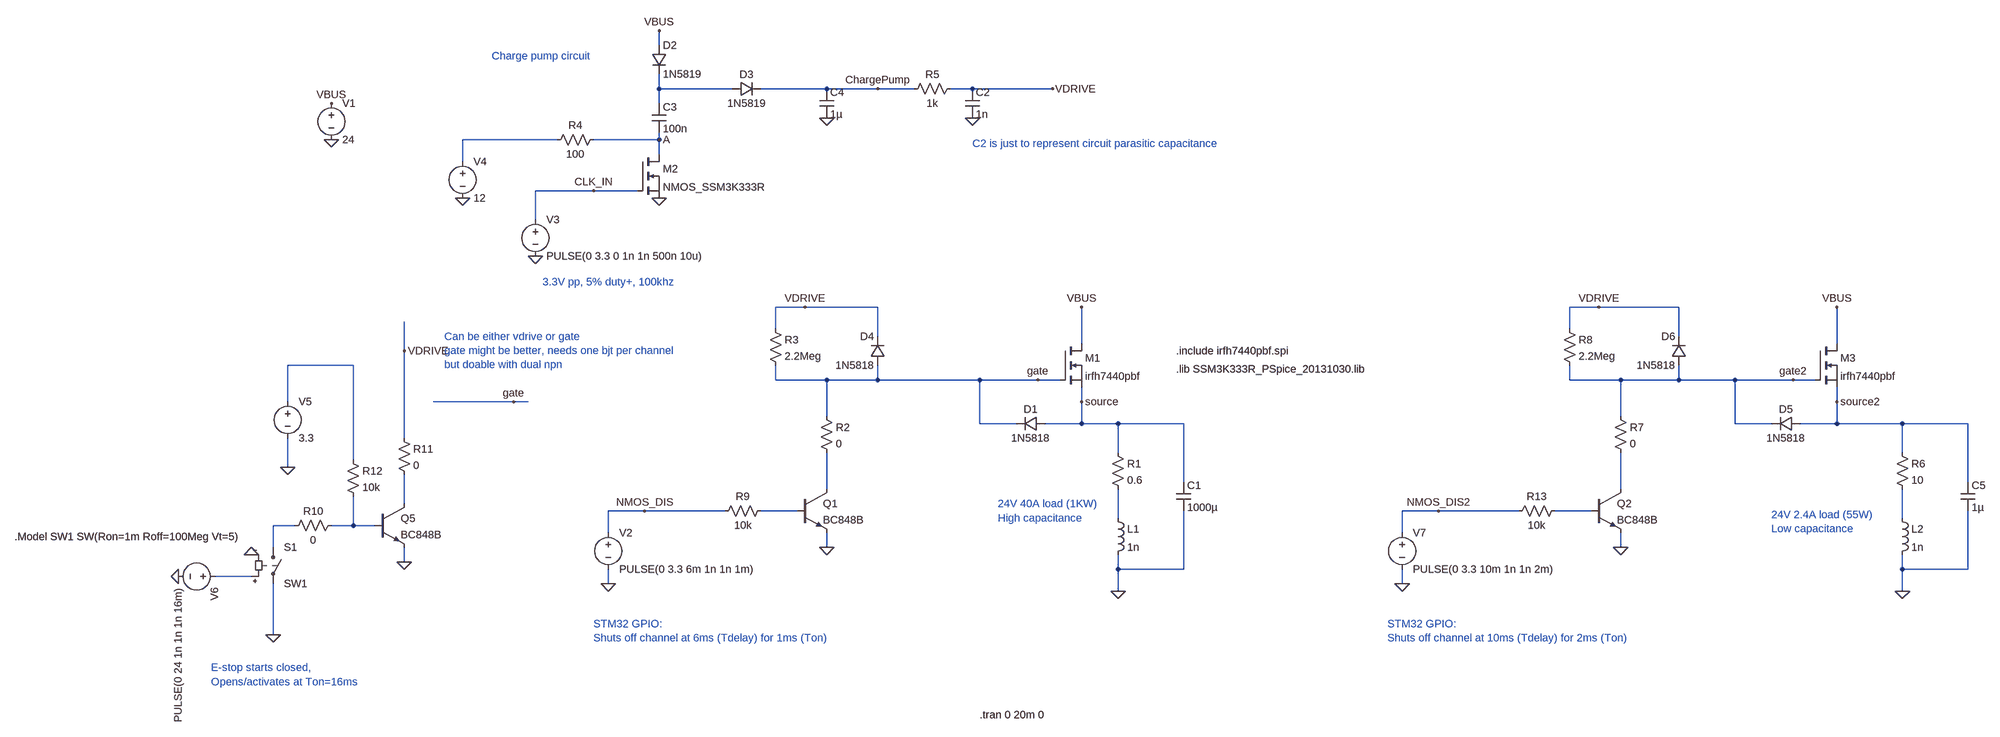
[diagram p0: schematic Bluesat_MPM_Testing.asc]
Bluesat_MPM_Testing.asc, the LTspice schematic file:
Version 4.1
SHEET 1 2628 980
WIRE -672 -576 -672 -608
WIRE -672 -480 -672 -512
WIRE -512 -480 -672 -480
WIRE -304 -480 -448 -480
WIRE -192 -480 -304 -480
WIRE -112 -480 -192 -480
WIRE 16 -480 -32 -480
WIRE 192 -480 16 -480
WIRE -672 -448 -672 -480
WIRE -896 -368 -1104 -368
WIRE -672 -368 -672 -384
WIRE -672 -368 -816 -368
WIRE -672 -336 -672 -368
WIRE -1104 -320 -1104 -368
WIRE -816 -256 -944 -256
WIRE -720 -256 -816 -256
WIRE -944 -192 -944 -256
WIRE -352 0 -416 0
WIRE -192 0 -352 0
WIRE 1392 0 1328 0
WIRE 1568 0 1392 0
WIRE -416 48 -416 0
WIRE 1328 48 1328 0
WIRE -192 64 -192 0
WIRE 1568 64 1568 0
WIRE 256 80 256 0
WIRE 2000 80 2000 0
WIRE -1232 96 -1232 32
WIRE -1344 128 -1488 128
WIRE -416 160 -416 128
WIRE -304 160 -416 160
WIRE -192 160 -192 128
WIRE -192 160 -304 160
WIRE 32 160 -192 160
WIRE 160 160 32 160
WIRE 208 160 160 160
WIRE 1328 160 1328 128
WIRE 1440 160 1328 160
WIRE 1568 160 1568 128
WIRE 1568 160 1440 160
WIRE 1776 160 1568 160
WIRE 1904 160 1776 160
WIRE 1952 160 1904 160
WIRE -1488 208 -1488 128
WIRE -992 208 -1168 208
WIRE -960 208 -992 208
WIRE 256 208 256 176
WIRE 2000 208 2000 176
WIRE -304 240 -304 160
WIRE 1440 240 1440 160
WIRE 32 256 32 160
WIRE 112 256 32 256
WIRE 256 256 256 208
WIRE 256 256 176 256
WIRE 336 256 256 256
WIRE 480 256 336 256
WIRE 1776 256 1776 160
WIRE 1856 256 1776 256
WIRE 2000 256 2000 208
WIRE 2000 256 1920 256
WIRE 2144 256 2000 256
WIRE 2288 256 2144 256
WIRE -1232 288 -1232 96
WIRE 336 320 336 256
WIRE 2144 320 2144 256
WIRE -1344 336 -1344 128
WIRE -1488 352 -1488 288
WIRE 480 384 480 256
WIRE 2288 384 2288 256
WIRE -304 400 -304 320
WIRE 1440 400 1440 320
WIRE -1232 432 -1232 368
WIRE -704 448 -784 448
WIRE -528 448 -704 448
WIRE -368 448 -448 448
WIRE 1040 448 960 448
WIRE 1216 448 1040 448
WIRE 1376 448 1296 448
WIRE 336 464 336 400
WIRE 2144 464 2144 400
WIRE -1472 480 -1520 480
WIRE -1344 480 -1344 416
WIRE -1344 480 -1392 480
WIRE -1296 480 -1344 480
WIRE -784 496 -784 448
WIRE 960 496 960 448
WIRE -1520 528 -1520 480
WIRE -304 528 -304 496
WIRE 1440 528 1440 496
WIRE -1232 560 -1232 528
WIRE 336 576 336 544
WIRE 480 576 480 448
WIRE 480 576 336 576
WIRE 2144 576 2144 544
WIRE 2288 576 2288 448
WIRE 2288 576 2144 576
WIRE -1568 592 -1648 592
WIRE -784 608 -784 576
WIRE 960 608 960 576
WIRE 336 624 336 576
WIRE 2144 624 2144 576
WIRE -1520 720 -1520 608
FLAG -1392 -368 0
FLAG 256 0 VBUS
FLAG -1392 -448 VBUS
FLAG -784 608 0
FLAG 336 624 0
FLAG -304 -416 0
FLAG -944 -112 0
FLAG -672 -240 0
FLAG -1104 -240 0
FLAG -672 -608 VBUS
FLAG -672 -368 A
FLAG -816 -256 CLK_IN
FLAG -304 528 0
FLAG 192 -480 VDRIVE
FLAG -704 448 NMOS_DIS
FLAG -352 0 VDRIVE
FLAG -1568 544 0
FLAG -1728 592 0
FLAG 160 160 gate
FLAG 256 208 source
FLAG -1520 720 0
FLAG -1232 560 0
FLAG -1232 96 VDRIVE
FLAG -1488 352 0
FLAG 16 -416 0
FLAG 2000 0 VBUS
FLAG 960 608 0
FLAG 1440 528 0
FLAG 1040 448 NMOS_DIS2
FLAG 1392 0 VDRIVE
FLAG 1904 160 gate2
FLAG 2000 208 source2
FLAG 2144 624 0
FLAG -192 -480 ChargePump
FLAG -992 208 gate
SYMBOL nmos 208 80 R0
SYMATTR InstName M1
SYMATTR Value irfh7440pbf
SYMATTR Prefix X
SYMBOL voltage -1392 -464 R0
SYMATTR InstName V1
SYMATTR Value 24
SYMBOL voltage -784 480 R0
WINDOW 123 0 0 Left 0
WINDOW 39 0 0 Left 0
SYMATTR InstName V2
SYMATTR Value PULSE(0 3.3 6m 1n 1n 1m)
SYMBOL res 320 304 R0
SYMATTR InstName R1
SYMATTR Value 0.6
SYMBOL ind 320 448 R0
SYMATTR InstName L1
SYMATTR Value 1n
SYMBOL cap 464 384 R0
SYMATTR InstName C1
SYMATTR Value 1000µ
SYMBOL diode 176 240 R90
WINDOW 0 0 32 VBottom 2
WINDOW 3 32 32 VTop 2
SYMATTR InstName D1
SYMATTR Value 1N5818
SYMBOL res -320 224 R0
SYMATTR InstName R2
SYMATTR Value 0
SYMBOL nmos -720 -336 R0
SYMATTR InstName M2
SYMATTR Value NMOS_SSM3K333R
SYMATTR Prefix X
SYMBOL cap -688 -448 R0
SYMATTR InstName C3
SYMATTR Value 100n
SYMBOL diode -688 -576 R0
SYMATTR InstName D2
SYMATTR Value 1N5819
SYMBOL diode -512 -464 R270
WINDOW 0 32 32 VTop 2
WINDOW 3 0 32 VBottom 2
SYMATTR InstName D3
SYMATTR Value 1N5819
SYMBOL cap -320 -480 R0
SYMATTR InstName C4
SYMATTR Value 1µ
SYMBOL voltage -944 -208 R0
WINDOW 123 0 0 Left 0
WINDOW 39 0 0 Left 0
SYMATTR InstName V3
SYMATTR Value PULSE(0 3.3 0 1n 1n 500n 10u)
SYMBOL voltage -1104 -336 R0
SYMATTR InstName V4
SYMATTR Value 12
SYMBOL res -800 -384 R90
WINDOW 0 0 56 VBottom 2
WINDOW 3 32 56 VTop 2
SYMATTR InstName R4
SYMATTR Value 100
SYMBOL npn -368 400 R0
SYMATTR InstName Q1
SYMATTR Value BC848B
SYMBOL diode -176 128 R180
WINDOW 0 24 64 Left 2
WINDOW 3 24 0 Left 2
SYMATTR InstName D4
SYMATTR Value 1N5818
SYMBOL res -432 32 R0
SYMATTR InstName R3
SYMATTR Value 2.2Meg
SYMBOL res -128 -464 R270
WINDOW 0 32 56 VTop 2
WINDOW 3 0 56 VBottom 2
SYMATTR InstName R5
SYMATTR Value 1k
SYMBOL sw -1520 512 R0
SYMATTR InstName S1
SYMATTR Value SW1
SYMBOL voltage -1632 592 R90
WINDOW 123 0 0 Left 0
WINDOW 39 0 0 Left 0
SYMATTR InstName V6
SYMATTR Value PULSE(0 24 1n 1n 1n 16m)
SYMBOL npn -1296 432 R0
SYMATTR InstName Q5
SYMATTR Value BC848B
SYMBOL res -1376 464 R90
WINDOW 0 0 56 VBottom 2
WINDOW 3 32 56 VTop 2
SYMATTR InstName R10
SYMATTR Value 0
SYMBOL voltage -1488 192 R0
SYMATTR InstName V5
SYMATTR Value 3.3
SYMBOL res -1248 272 R0
SYMATTR InstName R11
SYMATTR Value 0
SYMBOL res -1360 320 R0
SYMATTR InstName R12
SYMATTR Value 10k
SYMBOL cap 0 -480 R0
SYMATTR InstName C2
SYMATTR Value 1n
SYMBOL nmos 1952 80 R0
SYMATTR InstName M3
SYMATTR Value irfh7440pbf
SYMATTR Prefix X
SYMBOL diode 1920 240 R90
WINDOW 0 0 32 VBottom 2
WINDOW 3 32 32 VTop 2
SYMATTR InstName D5
SYMATTR Value 1N5818
SYMBOL res 1424 224 R0
SYMATTR InstName R7
SYMATTR Value 0
SYMBOL npn 1376 400 R0
SYMATTR InstName Q2
SYMATTR Value BC848B
SYMBOL diode 1584 128 R180
WINDOW 0 24 64 Left 2
WINDOW 3 24 0 Left 2
SYMATTR InstName D6
SYMATTR Value 1N5818
SYMBOL res 1312 32 R0
SYMATTR InstName R8
SYMATTR Value 2.2Meg
SYMBOL res 2128 304 R0
SYMATTR InstName R6
SYMATTR Value 10
SYMBOL ind 2128 448 R0
SYMATTR InstName L2
SYMATTR Value 1n
SYMBOL cap 2272 384 R0
SYMATTR InstName C5
SYMATTR Value 1µ
SYMBOL voltage 960 480 R0
WINDOW 123 0 0 Left 0
WINDOW 39 0 0 Left 0
SYMATTR InstName V7
SYMATTR Value PULSE(0 3.3 10m 1n 1n 2m)
SYMBOL res -432 432 R90
WINDOW 0 0 56 VBottom 2
WINDOW 3 32 56 VTop 2
SYMATTR InstName R9
SYMATTR Value 10k
SYMBOL res 1312 432 R90
WINDOW 0 0 56 VBottom 2
WINDOW 3 32 56 VTop 2
SYMATTR InstName R13
SYMATTR Value 10k
TEXT 32 896 Left 2 !.tran 0 20m 0
TEXT 464 96 Left 2 !.include irfh7440pbf.spi
TEXT 464 136 Left 2 !.lib SSM3K333R_PSpice_20131030.lib
TEXT -2088 504 Left 2 !.Model SW1 SW(Ron=1m Roff=100Meg Vt=5)
TEXT 16 -360 Left 2 ;C2 is just to represent circuit parasitic capacitance
TEXT -1656 792 Left 2 ;E-stop starts closed,\nOpens/activates at Ton=16ms
TEXT -928 -56 Left 2 ;3.3V pp, 5% duty+, 100khz
TEXT -816 696 Left 2 ;STM32 GPIO:\nShuts off channel at 6ms (Tdelay) for 1ms (Ton)
TEXT 928 696 Left 2 ;STM32 GPIO:\nShuts off channel at 10ms (Tdelay) for 2ms (Ton)
TEXT 1856 456 Left 2 ;24V 2.4A load (55W)\nLow capacitance
TEXT 72 432 Left 2 ;24V 40A load (1KW)\nHigh capacitance
TEXT -1040 -552 Left 2 ;Charge pump circuit
TEXT -1144 64 Left 2 ;Can be either vdrive or gate\ngate might be better, needs one bjt per channel\nbut doable with dual npn

The netlist it stands for:
* Bluesat_MPM_Testing.asc
X§M1 VBUS gate source irfh7440pbf  ; pins D G S
V1 VBUS 0 24
V2 NMOS_DIS 0 PULSE(0 3.3 6m 1n 1n 1m)
R1 source N009 0.6
L1 N009 0 1n
C1 source 0 1000µ
D1 source gate 1N5818
R2 gate N004 0
X§M2 A CLK_IN 0 NMOS_SSM3K333R  ; pins D G S
C3 N001 A 100n
D2 VBUS N001 1N5819
D3 N001 ChargePump 1N5819
C4 ChargePump 0 1µ
V3 CLK_IN 0 PULSE(0 3.3 0 1n 1n 500n 10u)
V4 N002 0 12
R4 A N002 100
Q1 N004 N007 0 0 BC848B
D4 gate VDRIVE 1N5818
R3 VDRIVE gate 2.2Meg
R5 ChargePump VDRIVE 1k
S1 N011 0 N013 0 SW1
V6 N013 0 PULSE(0 24 1n 1n 1n 16m)
Q5 N006 N012 0 0 BC848B
R10 N012 N011 0
V5 N003 0 3.3
R11 VDRIVE N006 0
R12 N003 N012 10k
C2 VDRIVE 0 1n
X§M3 VBUS gate2 source2 irfh7440pbf  ; pins D G S
D5 source2 gate2 1N5818
R7 gate2 N005 0
Q2 N005 N008 0 0 BC848B
D6 gate2 VDRIVE 1N5818
R8 VDRIVE gate2 2.2Meg
R6 source2 N010 10
L2 N010 0 1n
C5 source2 0 1µ
V7 NMOS_DIS2 0 PULSE(0 3.3 10m 1n 1n 2m)
R9 N007 NMOS_DIS 10k
R13 N008 NMOS_DIS2 10k
.model D D
.lib standard.dio
.model NPN NPN
.model PNP PNP
.lib standard.bjt
.tran 0 20m 0
.include irfh7440pbf.spi
.lib SSM3K333R_PSpice_20131030.lib
.Model SW1 SW(Ron=1m Roff=100Meg Vt=5)
* C2 is just to represent circuit parasitic capacitance
* E-stop starts closed,
* Opens/activates at Ton=16ms
* 3.3V pp, 5% duty+, 100khz
* STM32 GPIO:
* Shuts off channel at 6ms (Tdelay) for 1ms (Ton)
* STM32 GPIO:
* Shuts off channel at 10ms (Tdelay) for 2ms (Ton)
* 24V 2.4A load (55W)
* Low capacitance
* 24V 40A load (1KW)
* High capacitance
* Charge pump circuit
* Can be either vdrive or gate
* gate might be better, needs one bjt per channel
* but doable with dual npn
.backanno
.end